# Altium schematic sheet 100_ESP.SchDoc
size A; SheetNumber: 3; SheetTotal: 5
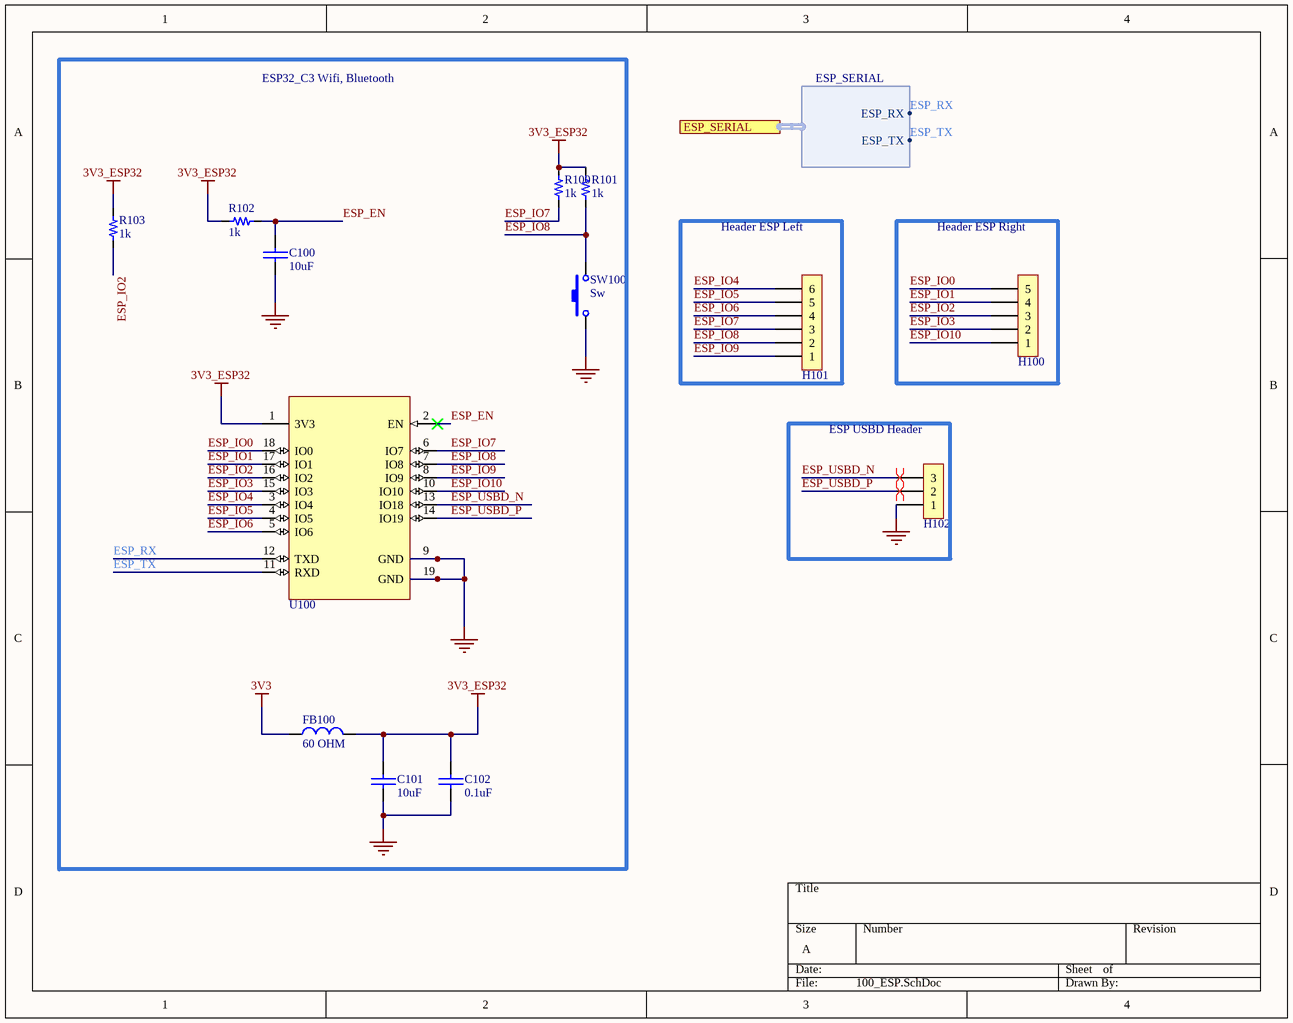
[diagram p0: 100_ESP.SchDoc]

## Parts
C100  value 10uF  [0805_cap]  (hidden comment: 10uF 25V)
C101  value 10uF  [0805_cap]  (hidden comment: 10uF 25V)
C102  value 0.1uF  [0603_cap]  (hidden comment: 0.1uF 50V)
FB100  value 60 OHM  [0603_fb]  (hidden comment: 60OHM 2A)
H100  5x1  [H_5x1_TH_100mil]  (value not drawn)  (no BOM)
H101  6x1  [H_6x1_TH_100mil]  (value not drawn)  (no BOM)
H102  3x1  [H_3X1_TH_100mil]  (value not drawn)  (no BOM)
R100  value 1k  [0603_res]  (hidden comment: 1k 1/10W)
R101  value 1k  [0603_res]  (hidden comment: 1k 1/10W)
R102  value 1k  [0603_res]  (hidden comment: 1k 1/10W)
R103  value 1k  [0603_res]  (hidden comment: 1k 1/10W)
SW100  Sw  [Sw_PUSH_4.5x4.5x5mm]
U100  ESP32-C3-WROOM-02-N4  [ESP32-C3-WROOM-02-N4]  (value not drawn)

## Blocks framed on the sheet
ESP32_C3 Wifi, Bluetooth: C100-C102 FB100 R100-R103 SW100 U100
Header ESP Left: H101
Header ESP Right: H100
ESP USBD Header: H102

## Ports
ESP_SERIAL (harness ESP_SERIAL, see Main[2B], 000_STM[3C])

## Harnesses
ESP_SERIAL: ESP_RX, ESP_TX

## Nets
3V3: FB100.1
3V3_ESP32: C101.1 C102.1 FB100.2 R100.2 R101.2 R102.2 R103.2 U100.1(3V3)
GND: C100.2 C101.2 C102.2 H102.1 SW100.1 U100.9(GND) U100.19(GND)
ESP_EN: C100.1 R102.1 U100.2(EN)
ESP_IO0: H100.5 U100.18(IO0)
ESP_IO1: H100.4 U100.17(IO1)
ESP_IO2: H100.3 R103.1 U100.16(IO2)
ESP_IO3: H100.2 U100.15(IO3)
ESP_IO4: H101.6 U100.3(IO4)
ESP_IO5: H101.5 U100.4(IO5)
ESP_IO6: H101.4 U100.5(IO6)
ESP_IO7: H101.3 R100.1 U100.6(IO7)
ESP_IO8: H101.2 R101.1 SW100.2 U100.7(IO8)
ESP_IO9: H101.1 U100.8(IO9)
ESP_IO10: H100.1 U100.10(IO10)
ESP_RX: U100.12(TXD) ; port ESP_SERIAL.ESP_RX
ESP_TX: U100.11(RXD) ; port ESP_SERIAL.ESP_TX
ESP_USBD_N: H102.3 U100.13(IO18)
ESP_USBD_P: H102.2 U100.14(IO19)

## Layout directives
differential pair; differential pair class USB_2.0_ESP: ESP_USBD_N, ESP_USBD_P

## Library data of the parts
C100 C101 = Cap_10uF_0805_25V_: 25V 10uF X5R ±10% 0805 Multilayer Ceramic Capacitors MLCC - SMD/SMT ROHS; Manufacturer: Samsung Electro-Mechanics; Manufacturer Part Number: CL21A106KAYNNNE; Supplier 1: LCSC; Supplier Part Number 1: C15850; ComponentLink1Description: LCSC; ComponentLink1URL: https://lcsc.com/product-detail/Multilayer-Ceramic-Capacitors-MLCC-SMD-SMT_Samsung-Electro-Mechanics-CL21A106KAYNNNE_C15850.html
C102 = Cap_0.1uF_0603_50V: 50V 100nF Y5V -20%~+80% 0603 Multilayer Ceramic Capacitors MLCC - SMD/SMT ROHS; Manufacturer: Walsin Tech Corp; Manufacturer Part Number: 0603F104Z500CT; Supplier 1: LCSC; Supplier Part Number 1: C83060; ComponentLink1Description: LCSC; ComponentLink1URL: https://www.lcsc.com/product-detail/Multilayer-Ceramic-Capacitors-MLCC-SMD-SMT_Walsin-Tech-Corp-0603F104Z500CT_C83060.html
FB100 = FB_60_0603_2A: 2A 1 100mΩ 60Ω@100MHz ±25% 0603 Ferrite Beads ROHS; Manufacturer: TAI-TECH; Manufacturer Part Number: HCB1608KF-600T20; ComponentLink1Description: LCSC; ComponentLink1URL: https://www.lcsc.com/product-detail/Ferrite-Beads_TAI-TECH-HCB1608KF-600T20_C369516.html; Supplier 1: LCSC; Supplier Part Number 1: C369516
H100 = H_Male_5x1_TH_100mil: ComponentLink1Description: LCSC
H101 = H_Male_6x1_TH_100mil: ComponentLink1Description: LCSC
H102 = H_Male_3x1_TH_100mil: ComponentLink1Description: LCSC
R100-R103 = Res_1k_0603_1/10W: RES SMD 1k OHM 5% 1/10W 0603; Manufacturer: FOJAN; Manufacturer Part Number: FRC0603J102 TS; ComponentLink1URL: https://www.lcsc.com/product-detail/Chip-Resistor-Surface-Mount_FOJAN-FRC0603J102-TS_C2907113.html; Supplier 1: LCSC; Supplier Part Number 1: C2907113; ComponentLink1Description: LCSC
SW100 = Sw_PUSH_4.5x4.5x5.0xmm: SWITCH TACTILE SPST-NO 0.05A 12V; Manufacturer: BZCN; Manufacturer Part Number: TSC015A05026A; Supplier 1: LCSC; Supplier Part Number 1: C2888509; Last modified by: N-A.Potosi; Last modified date: 20190222; ComponentLink1Description: LCSC; ComponentLink1URL: https://www.lcsc.com/product-detail/Tactile-Switches_BZCN-TSC015A05026A_C2888509.html
U100 = MCU_ESP32-C3-WROOM-02-N4: RF TXRX MOD BT WIFI PCB TH SMD; Manufacturer: Espressif Systems; Manufacturer Part Number: ESP32-C3-WROOM-02-N4; Supplier 1: LCSC; Supplier Part Number 1: C2934560; ComponentLink1Description: LCSC; ComponentLink1URL: https://lcsc.com/product-detail/WiFi-Modules_Espressif-Systems-ESP32-C3-WROOM-02-N4_C2934560.html